# Altium schematic sheet [05] - UART-USB.SchDoc: UART-USB
size A4; Author: Gabriel Piñango; DocumentNumber: 5; Revision: V1I1; SheetNumber: 5; SheetTotal: 6; Collaborator: Gabriel Pinango; Project: MultiTestcard; VersionRevision: V1I1; Designer: Gabriel Pinango
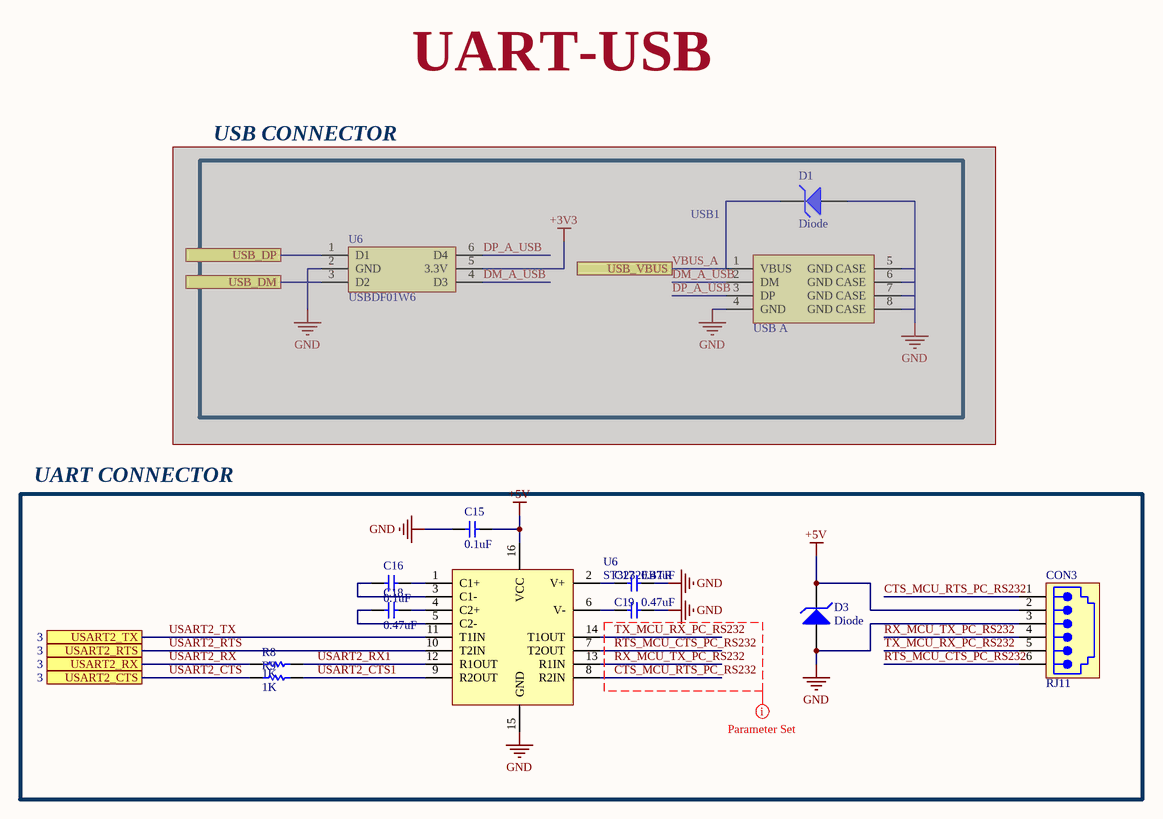
[diagram p0: [05] - UART-USB.SchDoc]

## Parts
(Parts that share a designator on the sheet are numbered #1, #2 ... from top to bottom, then left to right.)
C15  0.1uF  [CC-0603]
C16  0.1uF  [CC-0603]
C17  0.47uF  [CC-0603]
C18  0.47uF  [CC-0603]
C19  0.47uF  [CC-0603]
CON3  RJ11  [JACK1.02-2H6C]
D1  Diode  [SOD-523]  (masked out: inside a compile mask, not in the netlist)
D3  Diode  [SOD-523]
R8  1K  [R-0603]
R9  1K  [R-0603]
U6#1  USBDF01W6  [SOT323-6L]  (masked out: inside a compile mask, not in the netlist)
U6#2  ST3232EBTR  [TSSOP-16]
USB1  USB A  (masked out: inside a compile mask, not in the netlist)

## Blocks framed on the sheet
USB CONNECTOR: D1 U6#1 USB1
UART CONNECTOR: C15-C19 CON3 D3 R8 R9 U6#2

## Ports
USART2_CTS (see 3), USART2_RTS (see 3), USART2_RX (see 3), USART2_TX (see 3), USB_DM, USB_DP, USB_VBUS

## Nets
+5V: C15.1 CON3.2 D3.2(K) U6#2.16(VCC)
GND: C15.2 C17.2 C19.2 CON3.3 D3.1(A) U6#2.15(GND)
CTS_MCU_RTS_PC_RS232: CON3.1 U6#2.8(R2IN)
RTS_MCU_CTS_PC_RS232: CON3.6 U6#2.7(T2OUT)
RX_MCU_TX_PC_RS232: CON3.4 U6#2.13(R1IN)
TX_MCU_RX_PC_RS232: CON3.5 U6#2.14(T1OUT)
USART2_CTS: R9.1 ; port USART2_CTS
USART2_CTS1: R9.2 U6#2.9(R2OUT)
USART2_RTS: U6#2.10(T2IN) ; port USART2_RTS
USART2_RX: R8.1 ; port USART2_RX
USART2_RX1: R8.2 U6#2.12(R1OUT)
USART2_TX: U6#2.11(T1IN) ; port USART2_TX
NetC16_1: C16.1 U6#2.1(C1+)
NetC16_2: C16.2 U6#2.3(C1-)
NetC17_1: C17.1 U6#2.2(V+)
NetC18_1: C18.1 U6#2.4(C2+)
NetC18_2: C18.2 U6#2.5(C2-)
NetC19_1: C19.1 U6#2.6(V-)

## Layout directives
net class USART2_CON: CTS_MCU_RTS_PC_RS232, RTS_MCU_CTS_PC_RS232, RX_MCU_TX_PC_RS232, TX_MCU_RX_PC_RS232

## Notes on the sheet
- UART-USB
- Título
- Diseñado por
- Fecha:
- Proyecto
- Hora:
- Versión:
- Hoja
- de
- Archivo:

## Library data of the parts
C15 C16 = CGA3E2X7R1H104K080AA: CAP CER 0.1uF 50V X7R 0603; Manufacturer: TDK; Capacitance: 100nF; Tolerance: 10%; Supplier 1: Digi-Key; Manufacturer Part Number: CGA3E2X7R1H104K080AA; Stock 1: 11580568; Pricing 1: 1=0.1, 10=0.075, 100=0.0335, 500=0.0239, 1000=0.0188 (USD); Mount: Surface Mount; Case/Package: 0603; Weight: 7.1E-05oz; Case Code (Imperial): 0603; Case Code (Metric): 1608; Min Operating Temperature: -55°C; Max Operating Temperature: 125°C; Packaging: Tape and Reel; Package Quantity: 1; Voltage Rating: 50V; Dielectric: X7R; Voltage Rating (DC): 50V; Termination: SMD/SMT; Voltage: 50V; Composition: Ceramic; Length: 1.6mm; Height: 0.8mm; Width: 0.8mm; Thickness: 0.035inch; Depth: 0.8mm; Ratings: AEC-Q200; Radiation Hardening: No; REACH SVHC: No SVHC; Lead Free: Lead Free; ComponentLink1URL: http://www.farnell.com/datasheets/1796654.pdf?src-supplier=Mouser; ComponentLink1Description: http://www.farnell.com/datasheets/1796654.pdf?src-supplier=Mouser; ComponentLink2URL: http://product.tdk.com/capacitor/mlcc/en/documents/mlccspec_automotive_general_midvoltage_en.pdf?src-supplier=Future+Electronics; ComponentLink2Description: http://product.tdk.com/capacitor/mlcc/en/documents/mlccspec_automotive_general_midvoltage_en.pdf?src-supplier=Future+Electronics; ComponentLink3URL: http://www.farnell.com/datasheets/1735392.pdf?src-supplier=Element14; ComponentLink3Description: http://www.farnell.com/datasheets/1735392.pdf?src-supplier=Element14; ComponentLink4URL: https://www.verical.com/server-webapp/html/getDatasheet?partID=715867&src-supplier=Verical; ComponentLink4Description: https://www.verical.com/server-webapp/html/getDatasheet?partID=715867&src-supplier=Verical; ComponentLink5URL: http://www.farnell.com/datasheets/1796654.pdf?src-supplier=Newark; ComponentLink5Description: http://www.farnell.com/datasheets/1796654.pdf?src-supplier=Newark; Supplier Part Number 1: 445-5666-6-ND
C17-C19 = CL10B474KO8NNNC: Cap Ceramic 0.47uF 16V X7R 10% SMD 0603 125C T/R; Manufacturer: Samsung; Capacitance: 470nF; Supplier 1: Digi-Key; Manufacturer Part Number: CL10B474KO8NNNC; Stock 1: 123146; Pricing 1: 1=0.1, 10=0.077, 100=0.0342, 500=0.0244, 1000=0.0192 (USD); Mount: Surface Mount; Case/Package: 0603; Contact Plating: Tin; Case Code (Metric): 1608; Case Code (Imperial): 0603; Material: Ceramic; Min Operating Temperature: -55°C; Max Operating Temperature: 125°C; Packaging: Tape and Reel; Package Quantity: 1; Tolerance: 10%; Voltage Rating: 16V; Dielectric: X7R; Voltage: 16V; Voltage Rating (DC): 16V; Length: 1.6mm; Height: 0.8mm; Width: 0.031inch; Thickness: 0.035inch; Depth: 0.8mm; Radiation Hardening: No; Lead Free: Lead Free; ComponentLink1URL: https://www.verical.com/server-webapp/html/getDatasheet?partID=354055&src-supplier=Verical; ComponentLink1Description: https://www.verical.com/server-webapp/html/getDatasheet?partID=354055&src-supplier=Verical; ComponentLink2URL: http://www1.futureelectronics.com/doc/SAMSUNG/CLSERIES.pdf?src-supplier=Future+Electronics; ComponentLink2Description: http://www1.futureelectronics.com/doc/SAMSUNG/CLSERIES.pdf?src-supplier=Future+Electronics; ComponentLink3URL: http://www.rapidonline.com/pdf/71-0319.pdf?src-supplier=Rapid+Electronics; ComponentLink3Description: http://www.rapidonline.com/pdf/71-0319.pdf?src-supplier=Rapid+Electronics; ComponentLink4URL: https://www.distrelec.biz/Web/Downloads/_e/ng/MLCC_CatalogDownload2013_ENG.pdf?mime=application%2Fpdf&src-supplier=Distrelec; ComponentLink4Description: https://www.distrelec.biz/Web/Downloads/_e/ng/MLCC_CatalogDownload2013_ENG.pdf?mime=application%2Fpdf&src-supplier=Distrelec; ComponentLink5URL: https://produktinfo.conrad.com/datenblaetter/450000-474999/456266-da-01-en-VS_KONDENSATOR_0603.pdf?src-supplier=Conrad; ComponentLink5Description: https://produktinfo.conrad.com/datenblaetter/450000-474999/456266-da-01-en-VS_KONDENSATOR_0603.pdf?src-supplier=Conrad; Supplier Part Number 1: 1276-1062-6-ND
CON3 = 52018-6646: CONN MOD JACK R/A 6P6C; Manufacturer: Molex; Shielding: Unshielded; Number of Ports: 1; Number of Positions Loaded: 6; Connector Type: Socket; Gender: Female; Pitch: 2.04mm; Supplier 1: Digi-Key; Supplier Part Number 1: WM5465-ND; Manufacturer Part Number: 52018-6646; Stock 1: 8764; Pricing 1: 1=1.43, 10=1.294, 25=1.2144, 50=1.1616, 100=1.1088, 250=1.0032, 500=0.924, 1000=0.792, 2500=0.7392 (USD); Mount: Through Hole; Contact Material: Bronze; Contact Plating: Gold; Housing Color: Grey; Housing Material: Polyester; Color: Grey; Min Operating Temperature: -40°C; Max Operating Temperature: 80°C; Packaging: Tray; Package Quantity: 250; Termination: SMD/SMT; Number of Contacts: 6; Orientation: Right Angle; Number of Positions: 6; Length: 12.2mm; Depth: 13mm; Width: 13mm; Radiation Hardening: No; REACH SVHC: Unknown; Lead Free: Lead Free; Flammability Rating: UL94 V-0; ComponentLink1URL: https://www.verical.com/server-webapp/html/getDatasheet?partID=791748&src-supplier=Verical; ComponentLink1Description: https://www.verical.com/server-webapp/html/getDatasheet?partID=791748&src-supplier=Verical; ComponentLink2URL: http://www.jameco.com/Jameco/Products/ProdDS/801246.pdf?src-supplier=Jameco; ComponentLink2Description: http://www.jameco.com/Jameco/Products/ProdDS/801246.pdf?src-supplier=Jameco; ComponentLink3URL: http://www.molex.com/pdm_docs/sd/520188245_sd.pdf?src-supplier=Avnet; ComponentLink3Description: http://www.molex.com/pdm_docs/sd/520188245_sd.pdf?src-supplier=Avnet; ComponentLink4URL: http://www.onlinecomponents.com/productFiles/mf-MOL/520188245_sd.pdf?src-supplier=Onlinecomponents.com; ComponentLink4Description: http://www.onlinecomponents.com/productFiles/mf-MOL/520188245_sd.pdf?src-supplier=Onlinecomponents.com; ComponentLink5URL: http://www.mouser.com/ds/2/276/520186646_sd-208425.pdf?src-supplier=Mouser; ComponentLink5Description: http://www.mouser.com/ds/2/276/520186646_sd-208425.pdf?src-supplier=Mouser
D1 D3 = UCLAMP0501H.TCT: TVS DIODE 5VWM 12.5VC SOD523; Manufacturer: Semtech; Capacitance: 160pF; Number of Channels: 1; Direction: Unidirectional; Reverse Breakdown Voltage: 6V; Reverse Standoff Voltage: 5V; Clamping Voltage: 12.5V; Peak Pulse Power: 240W; Power Line Protection: No; Leakage Current: 5uA; Peak Pulse Current: 16A; Test Current: 1mA; Element Configuration: Single; Supplier 1: Digi-Key; Manufacturer Part Number: UCLAMP0501H.TCT; Stock 1: 29145; Pricing 1: 1=0.58, 10=0.51, 25=0.4788, 100=0.3909, 250=0.3631, 500=0.309, 1000=0.2472 (USD); Mount: Surface Mount; Number of Pins: 2; Min Operating Temperature: -55°C; Max Operating Temperature: 125°C; Packaging: Tape and Reel; Number of Elements: 1; Number of Unidirectional Channels: 1; Min Breakdown Voltage: 6V; Max Breakdown Voltage: 6V; Working Voltage: 5V; Polarity: Unidirectional; Breakdown Voltage: 6V; Max Power Dissipation: 240W; Voltage Rating (DC): 5V; Composition: Zener; Length: 1.3mm; Depth: 0.9mm; Width: 900um; Radiation Hardening: No; REACH SVHC: No SVHC; Lead Free: Lead Free; ComponentLink1URL: http://www.semtech.com/images/datasheet/uclamp0501h.pdf?src-supplier=Future+Electronics; ComponentLink1Description: http://www.semtech.com/images/datasheet/uclamp0501h.pdf?src-supplier=Future+Electronics; ComponentLink2URL: https://www.verical.com/server-webapp/html/getDatasheet?partID=51047&src-supplier=Verical; ComponentLink2Description: https://www.verical.com/server-webapp/html/getDatasheet?partID=51047&src-supplier=Verical; ComponentLink3URL: http://www.semtech.com/images/datasheet/uclamp0501h.pdf?src-supplier=Digi-Key; ComponentLink3Description: http://www.semtech.com/images/datasheet/uclamp0501h.pdf?src-supplier=Digi-Key; ComponentLink4URL: https://www.semtech.com/uploads/documents/uclamp0501h.pdf?src-supplier=Digi-Key; ComponentLink4Description: https://www.semtech.com/uploads/documents/uclamp0501h.pdf?src-supplier=Digi-Key; ComponentLink5URL: http://www.semtech.com/images/datasheet/uclamp0501h.pdf?src-supplier=Element14; ComponentLink5Description: http://www.semtech.com/images/datasheet/uclamp0501h.pdf?src-supplier=Element14; ComponentLink6URL: http://www.farnell.com/datasheets/1796175.pdf?src-supplier=Element14; ComponentLink6Description: http://www.farnell.com/datasheets/1796175.pdf?src-supplier=Element14; ComponentLink7URL: http://www.semtech.com/images/datasheet/uclamp0501h.pdf?src-supplier=Avnet; ComponentLink7Description: http://www.semtech.com/images/datasheet/uclamp0501h.pdf?src-supplier=Avnet; Supplier Part Number 1: UCLAMP0501HDKR-ND
R8 R9 = RC0603FR-071KL: RES SMD 1K OHM 1% 1/10W 0603; Manufacturer: Yageo; Resistance: 1kR; Power Rating: 100mW; Temperature Coefficient: 100ppm/°C; Voltage Rating: 50V; Supplier 1: Digi-Key; Manufacturer Part Number: RC0603FR-071KL; Stock 1: 48702346; Pricing 1: 1=0.1, 10=0.024, 100=0.0097, 1000=0.0044, 2500=0.0038 (USD); Case/Package: 0603; Case Code (Imperial): 0603; Case Code (Metric): 1608; Contact Plating: Tin,Matte; Min Operating Temperature: -55°C; Max Operating Temperature: 155°C; Tolerance: 1%; Packaging: Tape and Reel; Military Standard: Not; Termination: SMD/SMT; Composition: Thick Film; Length: 1.6mm; Height: 0.45mm; Depth: 0.8mm; Radiation Hardening: No; REACH SVHC: No SVHC; Lead Free: Lead Free; ComponentLink1URL: http://documents.rs-components.com/techlib://itc_doclist_GB.htm?stockno=5048928&src-supplier=RSComponents; ComponentLink1Description: http://documents.rs-components.com/techlib://itc_doclist_GB.htm?stockno=5048928&src-supplier=RSComponents; ComponentLink2URL: http://www.yageo.com/documents/recent/PYu-RC0603_51_RoHS_L_4.pdf?src-supplier=Avnet+Europe; ComponentLink2Description: http://www.yageo.com/documents/recent/PYu-RC0603_51_RoHS_L_4.pdf?src-supplier=Avnet+Europe; ComponentLink3URL: http://www.farnell.com/datasheets/2167052.pdf?src-supplier=Element14; ComponentLink3Description: http://www.farnell.com/datasheets/2167052.pdf?src-supplier=Element14; ComponentLink4URL: http://www.farnell.com/datasheets/1868787.pdf?src-supplier=Element14; ComponentLink4Description: http://www.farnell.com/datasheets/1868787.pdf?src-supplier=Element14; ComponentLink5URL: http://www.yageo.com/documents/recent/PYu-RC_Group_51_RoHS_L_2.pdf?src-supplier=Avnet; ComponentLink5Description: http://www.yageo.com/documents/recent/PYu-RC_Group_51_RoHS_L_2.pdf?src-supplier=Avnet; ComponentLink6URL: https://www.verical.com/server-webapp/html/getDatasheet?partID=404327&src-supplier=Verical; ComponentLink6Description: https://www.verical.com/server-webapp/html/getDatasheet?partID=404327&src-supplier=Verical; ComponentLink7URL: http://www.farnell.com/datasheets/443971.pdf?src-supplier=Element14; ComponentLink7Description: http://www.farnell.com/datasheets/443971.pdf?src-supplier=Element14; Supplier Part Number 1: 311-1.00KHRDKR-ND
U6#1 = USBDF02W6: STMICROELECTRONICS - USBUF02W6 - Analogue Filter, Lowpass, 2nd, SOT-323 RoHS Compliant: Yes; DC Resistance (DCR): 33R; Test Frequency: 30MHz; Number of Channels: 2; Capacitance: 47pF; Tolerance: 10%; Supplier 1: Digi-Key; Supplier Part Number 1: 497-3743-1-ND; Manufacturer: STMicroelectronics; Manufacturer Part Number: USBUF02W6; RoHS: Yes; Category: EMI / RFI Components; Stock 1: 59157; Pricing 1: 1=0.51000, 10=0.49100, 25=0.47520, 50=0.38800, 100=0.34850, 250=0.31680, 500=0.30096, 1000=0.26928 (USD); Mount: Surface Mount; Case/Package: SOT-323; Number of Pins: 6; Min Operating Temperature: -40°C; Max Operating Temperature: 70°C; ESD Protection: Yes; Termination: Gull Wing; Packaging: Tape and Reel; Package Quantity: 1; Length: 2.2mm; Width: 1.35mm; Height: 0.043inch; Depth: 2.4mm; Radiation Hardening: No; REACH SVHC: No SVHC; Lead Free: Lead Free; ComponentLink1URL: https://datasheet.ciiva.com/11795/0900766b8097d6dc-11795459.pdf?src-supplier=RSComponents; ComponentLink1Description: https://datasheet.ciiva.com/11795/0900766b8097d6dc-11795459.pdf?src-supplier=RSComponents; ComponentLink2URL: https://datasheet.ciiva.com/26793/usbuf02w6-26793358.pdf?src-supplier=IIIC; ComponentLink2Description: https://datasheet.ciiva.com/26793/usbuf02w6-26793358.pdf?src-supplier=IIIC; ComponentLink3URL: https://datasheet.ciiva.com/4479/cd00002046-4479544.pdf?src-supplier=Mouser; ComponentLink3Description: https://datasheet.ciiva.com/4479/cd00002046-4479544.pdf?src-supplier=Mouser; ComponentLink4URL: https://datasheet.ciiva.com/6212/cd00002046-6212812.pdf?src-supplier=Digi-Key; ComponentLink4Description: https://datasheet.ciiva.com/6212/cd00002046-6212812.pdf?src-supplier=Digi-Key; ComponentLink5URL: https://datasheet.ciiva.com/15162/getdatasheetpartid-131618-15162460.pdf?src-supplier=Verical; ComponentLink5Description: https://datasheet.ciiva.com/15162/getdatasheetpartid-131618-15162460.pdf?src-supplier=Verical; ComponentLink6URL: https://datasheet.ciiva.com/6212/cd00002046-6212814.pdf?src-supplier=Digi-Key; ComponentLink6Description: https://datasheet.ciiva.com/6212/cd00002046-6212814.pdf?src-supplier=Digi-Key
U6#2 = ST3232EBTR: IC DRVR/RCVR RS232 ESD 16-TSSOP; Manufacturer: STMicroelectronics; Data Rate: 250Kbps; Number of Receivers: 2; Max Supply Voltage: 5.5V; Min Supply Voltage: 3V; Nominal Supply Current: 1mA; Interface: RS-232; Number of Transceivers: 1; Logic Function: Receiver; Output Voltage: 13.2V; Supplier 1: Digi-Key; Supplier Part Number 1: 497-6536-6-ND; Manufacturer Part Number: ST3232EBTR; Stock 1: 24430; Pricing 1: 1=1.35, 10=1.21, 100=0.9433, 500=0.7793, 1000=0.6152 (USD); Mount: Surface Mount; Case/Package: TSSOP; Number of Pins: 16; Min Operating Temperature: -40°C; Max Operating Temperature: 85°C; Number of Transmitters: 2; Packaging: Tape and Reel; Package Quantity: 1; Number of Drivers: 2; Length: 5.1mm; Height: 1.05mm; Width: 4.48mm; Radiation Hardening: No; REACH SVHC: No SVHC; Lead Free: Lead Free; ComponentLink1URL: http://www.st.com/content/ccc/resource/technical/document/datasheet/60/fc/e5/60/2c/24/41/88/CD00002950.pdf/files/CD00002950.pdf/jcr:content/translations/en.CD00002950.pdf?src-supplier=Digi-Key; ComponentLink1Description: http://www.st.com/content/ccc/resource/technical/document/datasheet/60/fc/e5/60/2c/24/41/88/CD00002950.pdf/files/CD00002950.pdf/jcr:content/translations/en.CD00002950.pdf?src-supplier=Digi-Key; ComponentLink2URL: http://www.st.com/web/en/resource/technical/document/datasheet/CD00002950.pdf?src-supplier=Mouser; ComponentLink2Description: http://www.st.com/web/en/resource/technical/document/datasheet/CD00002950.pdf?src-supplier=Mouser; ComponentLink3URL: http://www.farnell.com/datasheets/1689894.pdf?src-supplier=Element14; ComponentLink3Description: http://www.farnell.com/datasheets/1689894.pdf?src-supplier=Element14; ComponentLink4URL: http://www.st.com/web/en/resource/technical/document/datasheet/CD00002950.pdf?src-supplier=Future+Electronics; ComponentLink4Description: http://www.st.com/web/en/resource/technical/document/datasheet/CD00002950.pdf?src-supplier=Future+Electronics
USB1 = 67329-8000: Conn USB RCP 4 POS 1.4mm Solder RA Thru-Hole 4 Terminal 1 Port Tray; Manufacturer: Molex; Gender: Female; Connector Type: USB,Receptacle; Number of Ports: 1; Number of Contacts: 4; Current Rating: 1A; Voltage Rating: 30V; USB Standard: USB 2.0; Supplier 1: Digi-Key; Supplier Part Number 1: WM17136-ND; Manufacturer Part Number: 67329-8000; Stock 1: 229; Pricing 1: 1=1.44, 10=1.264, 25=1.1896, 50=1.1398, 100=1.0903, 250=0.9912, 500=0.8921, 1000=0.793, 2500=0.7186 (USD); Mount: Through Hole; Contact Plating: Gold; Contact Material: Bronze; Number of Terminals: 4; Housing Material: Nylon; Color: Black; Housing Color: Black; Min Operating Temperature: 0°C; Max Operating Temperature: 40°C; Packaging: Tray; Termination: Solder; Orientation: Right Angle; Number of Positions: 4; Number of Rows: 2; Number of Circuits: 4; Length: 7mm; Pitch: 1.4mm; Depth: 13.68mm; Radiation Hardening: No; REACH SVHC: Unknown; Lead Free: Lead Free; Flammability Rating: UL94 V-0; ComponentLink1URL: http://www.mouser.com/ds/2/276/0673298000_IO_CONNECTORS-172152.pdf?src-supplier=Mouser; ComponentLink1Description: http://www.mouser.com/ds/2/276/0673298000_IO_CONNECTORS-172152.pdf?src-supplier=Mouser; ComponentLink2URL: http://www.onlinecomponents.com/productFiles/mf-MOL/1691700673298000_io_nectors.pdf?src-supplier=Onlinecomponents.com; ComponentLink2Description: http://www.onlinecomponents.com/productFiles/mf-MOL/1691700673298000_io_nectors.pdf?src-supplier=Onlinecomponents.com; ComponentLink3URL: http://www.molex.com/webdocs/datasheets/pdf/en-us/0673298000_IO_CONNECTORS.pdf?src-supplier=Avnet; ComponentLink3Description: http://www.molex.com/webdocs/datasheets/pdf/en-us/0673298000_IO_CONNECTORS.pdf?src-supplier=Avnet; ComponentLink4URL: http://uk.rs-online.com/webdocs/1380/0900766b81380101.pdf?src-supplier=RSComponents; ComponentLink4Description: http://uk.rs-online.com/webdocs/1380/0900766b81380101.pdf?src-supplier=RSComponents; ComponentLink5URL: https://www.verical.com/server-webapp/html/getDatasheet?partID=792148&src-supplier=Verical; ComponentLink5Description: https://www.verical.com/server-webapp/html/getDatasheet?partID=792148&src-supplier=Verical